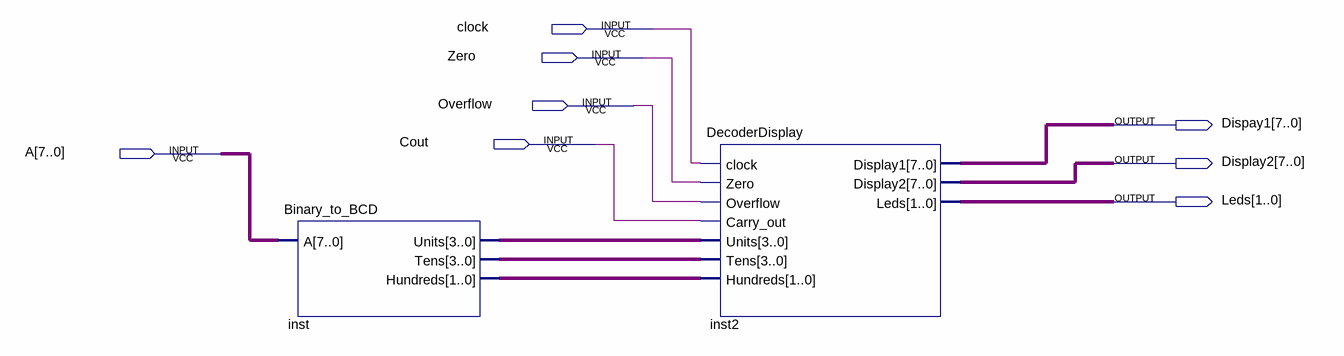
[diagram p0: schematic sheet]
// Quartus schematic TestDisplay.bdf as structural Verilog: 2 symbols, 8 pins
module TestDisplay (
  input  clock,
  input  Zero,
  input  Overflow,
  input  Cout,
  input  [7:0] A,
  output [7:0] Dispay1,
  output [7:0] Display2,
  output [1:0] Leds
);

  wire [1:0] inst_hundreds;
  wire [3:0] inst_tens, inst_units;

  Binary_to_BCD inst (.A(A), .Units(inst_units), .Tens(inst_tens), .Hundreds(inst_hundreds));
  DecoderDisplay inst2 (
    .clock(clock), .Zero(Zero), .Overflow(Overflow), .Carry_out(Cout), .Units(inst_units), .Tens(inst_tens),
    .Hundreds(inst_hundreds), .Display1(Dispay1), .Display2(Display2), .Leds(Leds));
endmodule
